# EAGLE design ESR_NM8032 (EAGLE 6.4)
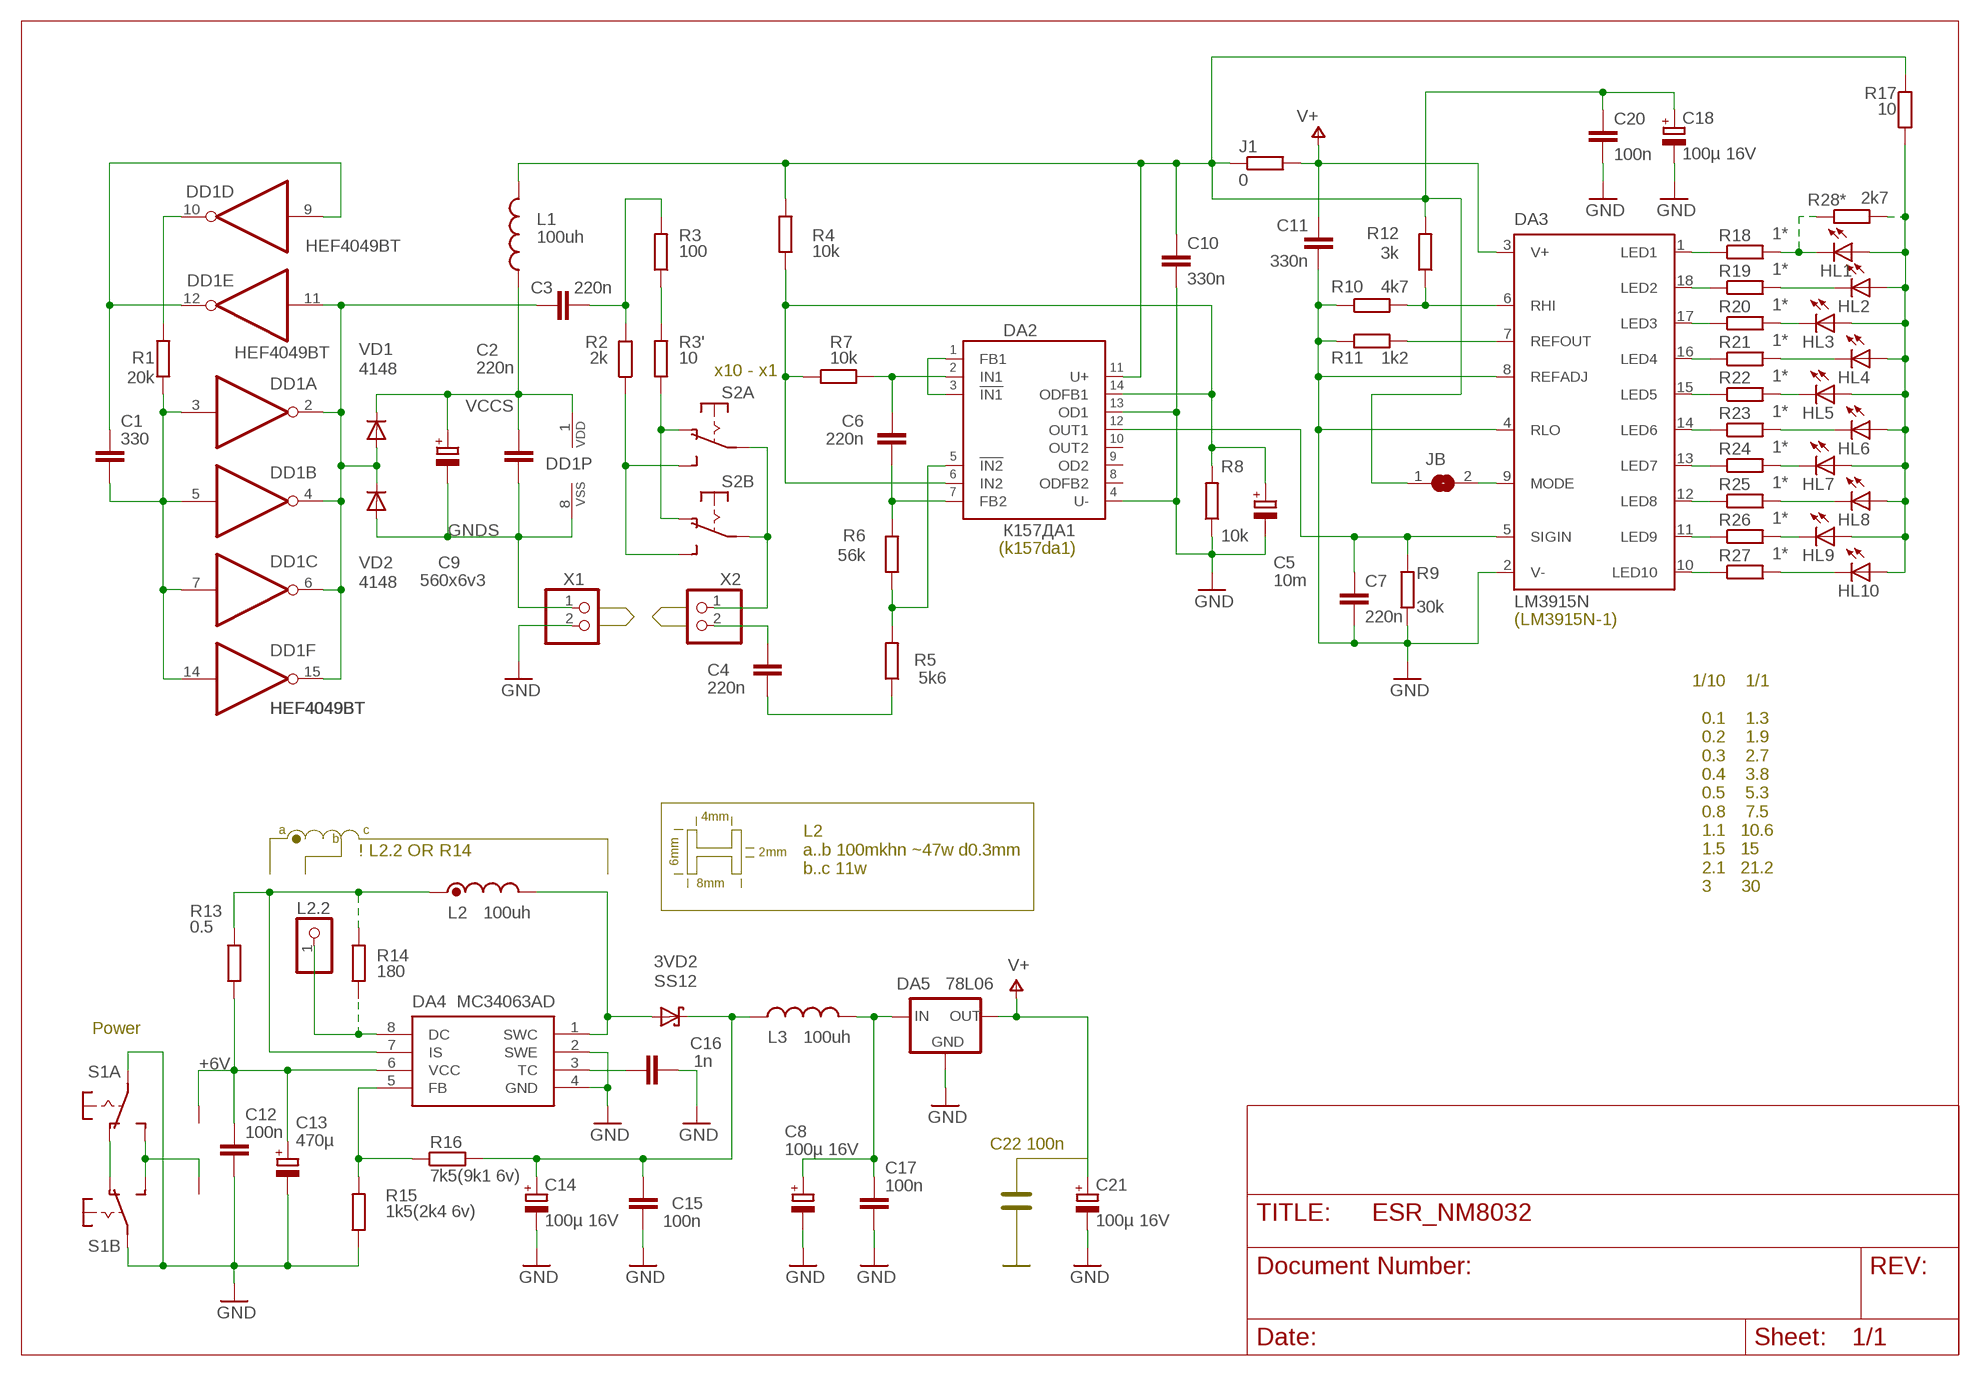
[diagram p0: schematic, sheet 1]

## Parts
3VD2  SS12  SCHOTTKY-DIODESMD  [SMB]
C1  330  C-EUC0805  [C0805]
C2  220n  C-EU075-032X103  [C075-032X103]
C3  220n  C-EUC0805  [C0805]
C4  220n  C-EUC0805  [C0805]
C5  10m  CPOL-EUE2-5  [E2-5]
C6  220n  C-EU075-032X103  [C075-032X103]
C7  220n  C-EUC0805  [C0805]
C8  100µ 16V  RCL_CPOL-EUE2.5-5  [RCL_E2,5-5]
C9  560x6v3  HWPROGUSB_RCL_CPOL-EUE3.5-8  [HWPROGUSB_RCL_E3,5-8]
C10  330n  C-EUC0805  [C0805]
C11  330n  C-EUC0805  [C0805]
C12  100n  C-EUC0805  [C0805]
C13  470µ  RCL_CPOL-EUE2.5-7  [RCL_E2,5-7]
C14  100µ 16V  RCL_CPOL-EUE2.5-5  [RCL_E2,5-5]
C15  100n  C-EUC0805  [C0805]
C16  1n  C-EUC0805  [C0805]
C17  100n  C-EUC0805  [C0805]
C18  100µ 16V  RCL_CPOL-EUE2.5-5  [RCL_E2,5-5]
C20  100n  C-EUC0805  [C0805]
C21  100µ 16V  RCL_CPOL-EUE2.5-5  [RCL_E2,5-5]
DA2  К157ДА1  K157DA1  [DIL14]
DA3  LM3915N  [DIL18]
DA4  MC34063AD  [SOIC8]
DA5  78L06  78LXX_SOT89  [SOT89R]
DD1  HEF4049BT  4049D  [SO16]
HL1  LED3MM  [LED3MM]
HL2  LED3MM  [LED3MM]
HL3  LED3MM  [LED3MM]
HL4  LED3MM  [LED3MM]
HL5  LED3MM  [LED3MM]
HL6  LED3MM  [LED3MM]
HL7  LED3MM  [LED3MM]
HL8  LED3MM  [LED3MM]
HL9  LED3MM  [LED3MM]
HL10  LED3MM  [LED3MM]
J1  0  R-EU_R1206W  [R1206W]
JB  SJ  [SJ]
L1  100uh  L-US0207/10  [0207/10]
L2  100uh  L-US0204/7  [0204/7]
L2.2  PINHD-1X1  [1X01]
L3  100uh  L-US0207/10  [0207/10]
R1  20k  R-EU_M0805  [M0805]
R2  2k  R-EU_M0805  [M0805]
R3  100  R-EU_M0805  [M0805]
R3'  10  R-EU_M0805  [M0805]
R4  10k  R-EU_R0805  [R0805]
R5  5k6  R-EU_M0805  [M0805]
R6  56k  R-EU_R0805  [R0805]
R7  10k  R-EU_R0805  [R0805]
R8  10k  R-EU_R0805  [R0805]
R9  30k  R-EU_R0805  [R0805]
R10  4k7  R-EU_R0805  [R0805]
R11  1k2  R-EU_R0805  [R0805]
R12  3k  R-EU_R0805  [R0805]
R13  0.5  R-EU_M1206  [M1206]
R14  180  R-EU_M0805  [M0805]
R15  1k5(2k4 6v)  R-EU_M0805  [M0805]
R16  7k5(9k1 6v)  R-EU_M0805  [M0805]
R17  10  R-EU_R0805  [R0805]
R18  1*  R-EU_R0805  [R0805]
R19  1*  R-EU_R0805  [R0805]
R20  1*  R-EU_R0805  [R0805]
R21  1*  R-EU_R0805  [R0805]
R22  1*  R-EU_R0805  [R0805]
R23  1*  R-EU_R0805  [R0805]
R24  1*  R-EU_R0805  [R0805]
R25  1*  R-EU_R0805  [R0805]
R26  1*  R-EU_R0805  [R0805]
R27  1*  R-EU_R0805  [R0805]
R28*  2k7  R-EU_R0805  [R0805]
S1  SWITCH9X4  [SWITCH9X4]
S2  SWITCH9X4  [SWITCH9X4]
U$2  B-  [B-]
U$4  B+  [B+]
VD1  4148  DIODE-SOD80C  [SOD80C]
VD2  4148  DIODE-SOD80C  [SOD80C]
X1  PINHD-1X2/2  [1X02]
X2  PINHD-1X2/2  [1X02]

## Nets
+6V: C12.1 C13.+ DA4.6(VCC) R13.1 U$4.P$1
GND: C5.- C7.2 C8.- C10.2 C11.2 C12.2 C13.- C14.- C15.1 C16.2 C17.2 C18.- C20.2 C21.- DA2.4(U-) DA2.13(OD1) DA3.2(V-) DA3.4(RLO) DA3.8(REFADJ) DA4.2(SWE) DA4.4(GND) DA5.3(GND) DA5.4(GND) R8.1 R9.1 R10.1 R11.1 R15.1 S1.10(A:P) S1.20(B:P) X1.2
GNDS: C2.2 C9.- DD1.8(P:VSS) VD2.A X1.1
N$1: C1.2 DD1.3(A:I) DD1.5(B:I) DD1.7(C:I) DD1.14(F:I) R1.1
N$2: C3.1 DD1.2(A:O) DD1.4(B:O) DD1.6(C:O) DD1.11(E:I) DD1.15(F:O) VD1.A VD2.C
N$3: HL1.K(C) R18.2 R28*.1
N$4: C1.1 DD1.9(D:I) DD1.12(E:O)
N$5: HL2.K(C) R19.2
N$6: DD1.10(D:O) R1.2
N$7: HL3.K(C) R20.2
N$8: HL4.K(C) R21.2
N$9: HL5.K(C) R22.2
N$10: HL6.K(C) R23.2
N$11: HL7.K(C) R24.2
N$12: HL8.K(C) R25.2
N$13: HL9.K(C) R26.2
N$14: HL10.K(C) R27.2
N$16: S2.10(A:P) S2.20(B:P) X2.1
N$17: R3'.2 R3.1
N$18: DA2.1(FB1) DA2.3(!IN1)
N$19: C4.1 X2.2
N$20: DA3.7(REFOUT) R11.2
N$21: DA3.6(RHI) R10.2 R12.1
N$22: C4.2 R5.1
N$23: S1.12(A:S) S1.22(B:S) U$2.P$1
N$24: C7.1 DA2.12(OUT1) DA3.5(SIGIN) R9.2
N$25: S1.11(A:O) S1.21(B:O)
N$26: C3.2 R2.2 R3.2
N$27: DA3.1(LED1) R18.1
N$28: HL1.A HL2.A HL3.A HL4.A HL5.A HL6.A HL7.A HL8.A HL9.A HL10.A R17.2 R28*.2
N$29: DA2.5(!IN2) R5.2 R6.1
N$30: DA4.8(DC) L2.2.1 R14.1
N$31: DA4.7(IS) L2.1 R13.2 R14.2
N$32: DA4.5(FB) R15.2 R16.1
N$33: 3VD2.A DA4.1(SWC) L2.2
N$34: C16.1 DA4.3(TC)
N$35: C6.1 DA2.2(IN1) R7.2
N$36: C6.2 DA2.7(FB2) R6.2
N$37: C5.+ DA2.6(IN2) DA2.14(ODFB1) R4.1 R7.1 R8.2
N$38: 3VD2.C C14.+ C15.2 L3.1 R16.2
N$39: DA3.18(LED2) R19.1
N$40: R3'.1 S2.11(A:O) S2.21(B:O)
N$41: C10.1 C18.+ C20.1 DA2.11(U+) J1.1 JB.1 L1.2 R4.2 R12.2 R17.1
N$42: R2.1 S2.12(A:S) S2.22(B:S)
N$43: DA3.17(LED3) R20.1
N$44: DA3.16(LED4) R21.1
N$45: DA3.15(LED5) R22.1
N$46: DA3.14(LED6) R23.1
N$47: DA3.13(LED7) R24.1
N$48: DA3.12(LED8) R25.1
N$49: DA3.11(LED9) R26.1
N$50: DA3.10(LED10) R27.1
N$54: DA3.9(MODE) JB.2
N$55: C8.+ C17.1 DA5.1(IN) L3.2
V+: C11.1 C21.+ DA3.3(V+) DA5.2(OUT) J1.2
VCCS: C2.1 C9.+ DD1.1(P:VDD) L1.1 VD1.C
Unconnected: DA2.8(ODFB2) DA2.9(OD2) DA2.10(OUT2)

## Notes on the sheet
- x10 - x1
- (k157da1)
- (LM3915N-1)
- 4mm
- a | c
- b
- ! L2.2 OR R14 | 2mm
- 6mm
- L2 
  a..b 100mkhn ~47w d0.3mm
  b..c 11w
- 8mm
- 1/10    1/1
  
    0.1    1.3
    0.2    1.9
    0.3    2.7
    0.4    3.8
    0.5    5.3
    0.8    7.5
    1.1   10.6
    1.5   15
    2.1   21.2
    3      30
- Power
- C22 100n

## Library data of the parts
3VD2 = diode:SCHOTTKY-DIODE: Schottky Diode
C1-C4 C6 C7 C10 C11 C15-C17 C20 = rcl:C-EU: CAPACITOR, European symbol
C5 = rcl:CPOL-EU: POLARIZED CAPACITOR, European symbol
C8 C13 C14 C18 C21 = HWProgUSB:RCL_CPOL-EU: POLARIZED CAPACITOR, European symbol
C9 = HWProgUSB:HWPROGUSB_RCL_CPOL-EU: POLARIZED CAPACITOR, European symbol
C12 = rc-elektronik:C-EU: CAPACITOR, European symbol
DA2 = ESR_NM8032:K157DA1
DA3 = national-semiconductor:LM391: Dot/Bar Display Driver Source: Data sheet LM3915 <http://www.national.com/ds/LM/LM3915.pdf> Data sheet LM3914 <http://www.national.com/ds/LM/LM3914.pdf>
DA4 = mc34063:MC34063
DA5 = ct-pack:78LXX: VOLTAGE REGULATOR
DD1 = 40xx:4049: Hex inverting BUFFER
HL1-HL10 = led:LED: LED OSRAM: - CHIPLED LG R971, LG N971, LY N971, LG Q971, LY Q971, LO R971, LY R971 LH N974, LH R974 LS Q976, LO Q976, LY Q976 LO Q996 - Hyper CHIPLED LW Q18S LB Q993, LB Q99A, LB R99A - SideLED LS A670, LO A670, LY A670, LG A670, LP A670 LB A673, LV A673, LT A673, LW A673 LH A674 LY A675 LS A676, LA A676, LO A676, LY A676, LW A676 LS A679, LY A679, LG A679 - Hyper Micro SIDELED® LS Y876, LA Y876, LO Y876, LY Y876 LT Y87S - SmartLED LW L88C, LW L88S LB L89C, LB L89S, LG L890 LS L89K, LO L89K, LY L89K LS L896, LA L896, LO L896, LY L896 - TOPLED LS T670, LO T670, LY T670, LG T670, LP T670 LSG T670, LSP T670, LSY T670, LOP T670, LYG T670 LG T671, LOG T671, LSG T671 LB T673, LV T673, LT T673, LW T673 LH T674 LS T676, LA T676, LO T676, LY T676, LB T676, LH T676, LSB T676, LW T676 LB T67C, LV T67C, LT T67C, LS T67K, LO T67K, LY T67K, LW E67C LS E67B, LA E67B, LO E67B, LY E67B, LB E67C, LV E67C, LT E67C LW T67C LS T679, LY T679, LG T679 LS T770, LO T770, LY T770, LG T770, LP T770 LB T773, LV T773, LT T773, LW T773 LH T774 LS E675, LA E675, LY E675, LS T675 LS T776, LA T776, LO T776, LY T776, LB T776 LHGB T686 LT T68C, LB T68C - Hyper Mini TOPLED® LB M676 - Mini TOPLED Santana® LG M470 LS M47K, LO M47K, LY M47K Source: http://www.osram.convergy.de LUXEON: - LUMILED® LXK2-PW12-R00, LXK2-PW12-S00, LXK2-PW14-U00, LXK2-PW14-V00 LXK2-PM12-R00, LXK2-PM12-S00, LXK2-PM14-U00 LXK2-PE12-Q00, LXK2-PE12-R00, LXK2-PE12-S00, LXK2-PE14-T00, LXK2-PE14-U00 LXK2-PB12-K00, LXK2-PB12-L00, LXK2-PB12-M00, LXK2-PB14-N00, LXK2-PB14-P00, LXK2-PB14-Q00 LXK2-PR12-L00, LXK2-PR12-M00, LXK2-PR14-Q00, LXK2-PR14-R00 LXK2-PD12-Q00, LXK2-PD12-R00, LXK2-PD12-S00 LXK2-PH12-R00, LXK2-PH12-S00 LXK2-PL12-P00, LXK2-PL12-Q00, LXK2-PL12-R00 Source: www.luxeon.com KINGBRIGHT: KA-3528ASYC Source: www.kingbright.com
J1 R1-R3 R3' R4-R27 R28* = rcl:R-EU_: RESISTOR, European symbol
JB = jumper:SJ: SMD solder JUMPER
L1-L3 = rcl:L-US: INDUCTOR, American symbol
L2.2 = pinhead:PINHD-1X1: PIN HEADER
S1 S2 = ESR_NM8032:SWITCH9X4
U$2 = ESR_NM8032:B-
U$4 = ESR_NM8032:B+
VD1 VD2 = diode:DIODE-: DIODE
X1 X2 = Разъёмы штырьковые 2.54мм:PINHD-1X2: PIN HEADER

## Board
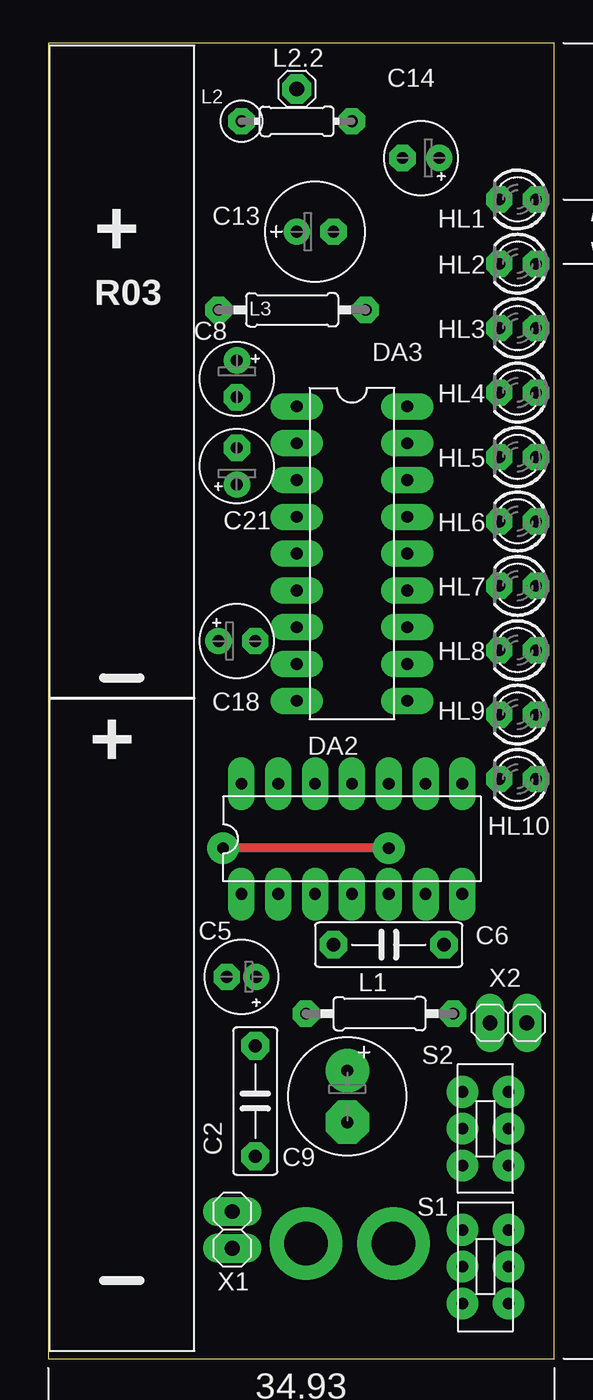
[diagram p1: board, top side]
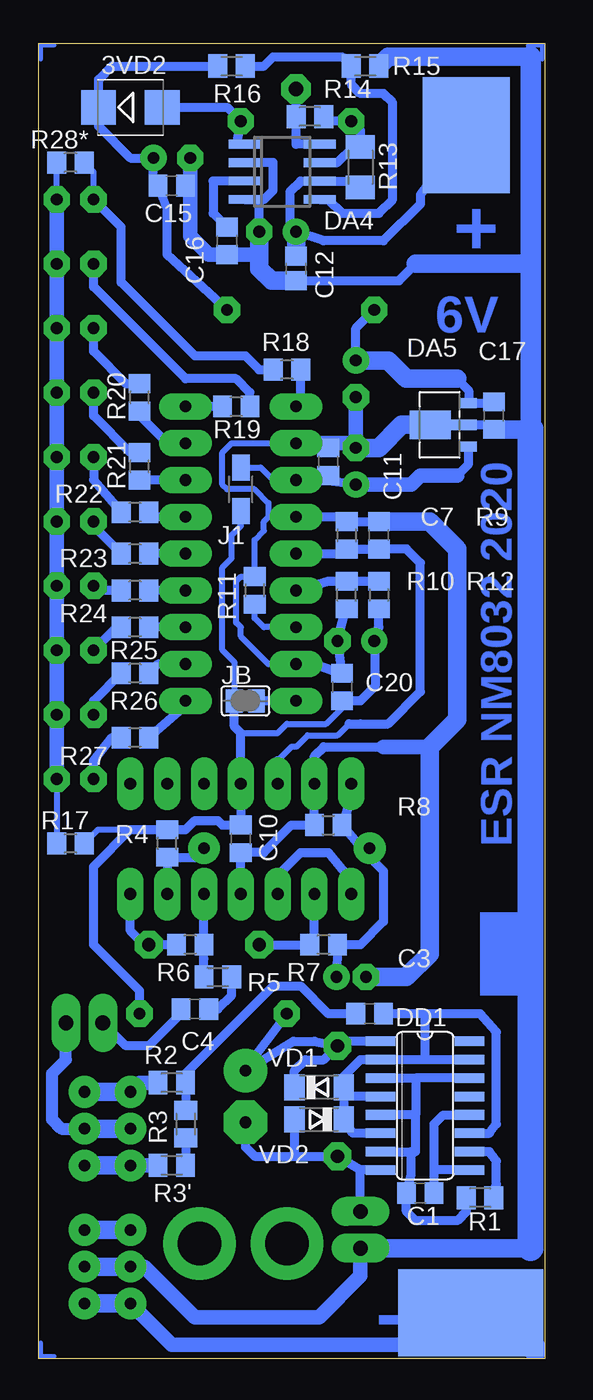
[diagram p2: board, bottom side, seen from below]

Size 34.91 x 90.79 mm. Coordinates in mm from the lower left corner, seen from the top.
Outline: 0,0 34.91,0 34.91,90.79 0,90.79 0,0
Copper layers (1*16): Top 0.035mm / dielectric 1.5mm / Bottom 0.035mm
Design rules "DesignRules": minimum track width 8mil, minimum drill 24mil, track to track 0.2mm, track to pad 0.2mm, pad to pad 8mil, via to via 8mil, smd to smd 8mil, copper to edge 10mil, drill to drill 8mil, minimum pad ring 0.5mm, minimum via ring 8mil, stop-mask expansion 4mil, vias tented up to drill 0mil, thermal gap 10mil

### Footprints (pad centres in the part's own frame; a part is rotated, then mirrored left to right if it is on the bottom)
SMB = smd 2.4 x 2.4: A 2.2,0; C -2.2,0
C0805 = smd 1.3 x 1.5: 1 -0.95,0; 2 0.95,0
C075-032X103 = drill 0.914 octagon: 1 -3.81,0; 2 3.81,0
E2-5 = drill 0.813 pad 1.27: + -1.016,0 | drill 0.813 pad 1.27 octagon: - 1.016,0
RCL_E2,5-5 = drill 0.813 pad 1.6: + -1.27,0 | drill 0.813 pad 1.6 octagon: - 1.27,0
HWPROGUSB_RCL_E3,5-8 = drill 0.813 pad 3: + -1.778,0 | drill 0.813 pad 3 octagon: - 1.778,0
C0805' = smd 1.3 x 1.5: 1 -0.85,0; 2 0.85,0
RCL_E2,5-7 = drill 0.813 pad 1.6: + -1.27,0 | drill 0.813 pad 1.6 octagon: - 1.27,0
DIL14 = drill 0.813 long: 1 -7.62,-3.81; 2 -5.08,-3.81; 3 -2.54,-3.81; 4 0,-3.81; 5 2.54,-3.81; 6 5.08,-3.81; 7 7.62,-3.81; 8 7.62,3.81; 9 5.08,3.81; 10 2.54,3.81; 11 0,3.81; 12 -2.54,3.81; 13 -5.08,3.81; 14 -7.62,3.81
DIL18 = drill 0.813 long: 1 -10.16,-3.81; 2 -7.62,-3.81; 3 -5.08,-3.81; 4 -2.54,-3.81; 5 0,-3.81; 6 2.54,-3.81; 7 5.08,-3.81; 8 7.62,-3.81; 9 10.16,-3.81; 10 10.16,3.81; 11 7.62,3.81; 12 5.08,3.81; 13 2.54,3.81; 14 0,3.81; 15 -2.54,3.81; 16 -5.08,3.81; 17 -7.62,3.81; 18 -10.16,3.81
SOIC8 = smd 0.6 x 2.2: 1 -1.905,-2.6; 2 -0.635,-2.6; 3 0.635,-2.6; 4 1.905,-2.6; 5 1.905,2.6; 6 0.635,2.6; 7 -0.635,2.6; 8 -1.905,2.6
SOT89R = smd 0.7 x 1.1: 1 1.5,-1.75; 2 -1.5,-1.75 | smd 0.7 x 1.8: 3 0,-1.4 | smd 2 x 2.8: 4 0,0.9
SO16 = smd 0.66 x 2.032: 1 -4.445,-3.073; 2 -3.175,-3.073; 3 -1.905,-3.073; 4 -0.635,-3.073; 5 0.635,-3.073; 6 1.905,-3.073; 7 3.175,-3.073; 8 4.445,-3.073; 9 4.445,3.073; 10 3.175,3.073; 11 1.905,3.073; 12 0.635,3.073; 13 -0.635,3.073; 14 -1.905,3.073; 15 -3.175,3.073; 16 -4.445,3.073
LED3MM = drill 0.813 octagon: A -1.27,0; K 1.27,0
R1206W = smd 1.8 x 1.2: 1 -1.499,0; 2 1.499,0
SJ = smd 1.168 x 1.6: 1 -0.762,0; 2 0.762,0
0207/10 = drill 0.813 octagon: 1 -5.08,0; 2 5.08,0
0204/7 = drill 0.813 octagon: 1 -3.81,0; 2 3.81,0
1X01 = drill 1.016 octagon: 1 0,0
M0805 = smd 1.3 x 1.6: 1 -0.95,0; 2 0.95,0
R0805 = smd 1.3 x 1.5: 1 -0.95,0; 2 0.95,0
M1206 = smd 1.6 x 2: 1 -1.4,0; 2 1.4,0
SWITCH9X4 = drill 0.8 pad 2.184: 10 -1.587,0; 11 -1.587,2.54; 12 -1.587,-2.54; 20 1.587,0; 21 1.587,2.54; 22 1.587,-2.54
B- = smd 10 x 6: P$1 0,0
B+ = smd 6 x 8: P$1 0,0
SOD80C = smd 1.4 x 1.8: A 1.7,0; C -1.7,0
1X02 = drill 1.016 long: 1 -1.27,0; 2 1.27,0

### Placement (x,y rotation side)
3VD2  28.57,86.36 0 bottom
C1  8.57,11.43 180 bottom
C2  14.29,17.78 270 top
C3  12.06,23.81 180 bottom
C4  24.13,24.13 0 bottom
C5  13.34,26.35 180 top
C6  23.49,28.57 0 top
C7  11.43,56.83 90 bottom
C8  13.02,67.63 270 top
C9  20.64,18.1 270 top
C10  20.95,35.88 270 bottom
C11  14.92,61.91 90 bottom
C12  100n  [C0805']  17.14,75.25 270 bottom
C13  18.41,77.79 0 top
C14  25.72,82.87 180 top
C15  25.72,80.96 180 bottom
C16  21.91,77.15 270 bottom
C17  3.49,65.09 270 bottom
C18  13.02,49.53 0 top
C20  13.97,46.36 90 bottom
C21  13.02,61.6 90 top
DA2  20.95,35.88 0 top
DA3  20.95,55.56 270 top
DA4  18.1,81.91 270 bottom
DA5  6.99,64.45 90 bottom
DD1  8.26,17.46 270 bottom
HL1  32.39,80.01 180 top
HL2  32.39,75.56 180 top
HL3  32.39,71.12 180 top
HL4  32.39,66.67 180 top
HL5  32.39,62.23 180 top
HL6  32.39,57.79 180 top
HL7  32.39,53.34 180 top
HL8  32.39,48.9 180 top
HL9  32.39,44.45 180 top
HL10  32.39,40.01 180 top
J1  20.95,60.01 90 bottom
JB  20.64,45.4 0 bottom
L1  22.86,23.81 0 top
L2  17.14,85.41 0 top
L2.2  17.14,87.63 0 top
L3  16.83,72.39 180 top
R1  4.45,11.11 0 bottom
R2  25.72,19.05 0 bottom
R3  24.76,16.19 90 bottom
R3'  25.72,13.33 0 bottom
R4  26.04,35.56 90 bottom
R5  22.54,26.35 180 bottom
R6  24.45,28.57 180 bottom
R7  15.24,28.57 180 bottom
R8  14.92,36.83 0 bottom
R9  13.65,56.83 270 bottom
R10  13.65,52.71 90 bottom
R11  20,53.02 270 bottom
R12  11.43,52.71 270 bottom
R13  12.7,82.23 90 bottom
R14  16.19,85.72 0 bottom
R15  12.38,89.22 180 bottom
R16  21.59,89.22 180 bottom
R17  32.7,35.56 180 bottom
R18  17.78,68.26 180 bottom
R19  21.27,65.72 0 bottom
R20  27.94,66.36 90 bottom
R21  27.94,61.6 90 bottom
R22  28.26,58.42 180 bottom
R23  28.26,55.56 180 bottom
R24  28.26,53.02 180 bottom
R25  28.26,50.48 180 bottom
R26  28.26,47.31 180 bottom
R27  28.26,42.86 180 bottom
R28*  32.7,82.55 180 bottom
S1  30.16,6.35 0 top
S2  30.16,15.88 180 top
U$1  [LR03]  5.08,22.54 90 top
U$2  5.08,3.17 0 bottom
U$3  [LR03]  5.08,67.63 90 top
U$4  5.4,84.45 0 bottom
VD1  15.56,18.73 0 bottom
VD2  15.56,16.51 180 bottom
X1  12.7,8.89 270 top
X2  31.75,23.18 180 top

### Tracks (layer width: path | path; a pad name or v marks a point on that pad's centre or on a via)
+6V
  Bottom 0.61: U$4.P$1 8.57,80.33 8.57,79.69 11.11,77.15 15.24,77.15 C13.+ 17.56,78.21 17.56,80.54 16.83,81.28 DA4.6 13.15,81.28 R13.1
  Bottom 1.27: C13.+ C12.1
GND
  Bottom 0.305: 0.16,89.69 0.16,90.65 1.11,90.65 1.11,89.85
  Bottom 0.406: DA3.8 19.05,47.94 20.95,49.85 20.95,50.48 21.27,50.8 21.27,53.66 20.95,53.98 R11.1 20,56.52 19.37,57.15 19.37,57.79 19.05,58.1 | DA3.2 21.59,63.18 22.22,62.55 22.22,60.32 21.91,60.01 20,60.01 19.05,59.05 19.05,58.1 | DA3.4 19.05,58.1
  Bottom 0.61: DA2.4 C10.2 19.36,34.93 17.46,36.83 R8.1 15.88,38.1 DA2.13 15.88,41.59 15.24,42.23 11.11,42.23 | DA4.4 19.68,80.01 | 19.68,80.01 19.37,80.01 18.73,80.64 18.73,82.55 DA4.2 | R10.1 13.72,51.69 C18.- 14.03,47.56 C20.2 15.88,47.94 DA3.8 | C7.2 R9.1 14.29,58.1 DA3.4 | DA5.4 DA5.3 3.81,64.45 C17.2 | C13.- 19.68,80.01 | C11.2 14.92,63.18 | C12.2 10.06,74.4 8.89,75.56
  Bottom 1.016: 19.68,76.2 C16.2 23.18,76.2 24.45,77.47 24.45,80.96 | X1.2 12.7,5.72 15.56,2.86 24.13,2.86 27.62,6.35 S1.10 | 12.77,62.86 C21.- | C21.- C8.- | DA3.2 14.92,63.18 13.59,63.18 C21.- | 11.11,42.23 7.94,42.23 | C14.- 24.45,80.96 | C15.1 24.45,80.96
  Bottom 1.27: 0.95,89.85 1.11,89.85 10.8,89.85 R15.1 | 0.95,7.62 X1.2 | C17.2 1.59,64.14 0.95,64.13 | C13.- 19.68,76.2 19.68,75.25 18.83,74.4 C12.2 | C5.- 9.53,26.35 7.94,27.94 7.94,42.23 6.03,44.13 6.03,55.88 7.94,57.78 C7.2 | S1.10 S1.20 | DA5.4 9.84,64.45 11.43,62.87 C21.- | 8.89,75.56 0.95,75.56
  Bottom 1.422: 0.95,64.13 0.95,75.56 0.95,89.85
  Bottom 1.778: 0.95,7.62 0.95,64.13
GNDS
  Bottom 0.61: DD1.8 12.7,13.02 | 12.7,13.02 C2.2 17.26,13.97 | VD2.A 17.26,13.97 | X1.1 12.7,13.02 | C9.- 20.64,14.61 20,13.97 17.26,13.97
N$1
  Bottom 0.61: DD1.14 8.89,19.37 | DD1.3 8.89,19.37 | 8.89,19.37 8.89,16.83 | 8.89,16.83 DD1.5 | DD1.7 9.21,14.29 | 9.21,14.29 8.89,14.29 8.89,16.83 | R1.1 5.4,10.16 6.03,9.52 8.89,9.52 9.53,10.16 C1.2 9.21,12.7 9.21,14.29
N$2
  Bottom 0.61: DD1.11 3.81,15.56 3.33,16.19 3.33,22.54 4.45,23.81 8.26,23.81 | 8.26,23.81 8.26,20.64 | DD1.15 8.26,20.64 | 8.26,20.64 DD1.2 12.7,20.64 13.86,19.48 VD1.A 13.86,18.1 | 13.86,18.1 VD2.C 13.22,15.56 DD1.6 | DD1.4 13.86,18.1 | 8.26,23.81 C3.1
N$3
  Bottom 0.406: HL1.K 31.11,81.91 R28*.1
  Bottom 0.61: HL1.K 29.21,78.1 29.21,74.3 24.13,69.21 20.64,69.21 19.68,68.26 R18.2
N$4
  Bottom 0.61: 7.62,13.02 7.62,16.19 6.99,16.83 DD1.12 | DD1.9 7.62,13.02 | C1.1 7.62,13.02
N$5
  Bottom 0.61: R19.2 20.32,66.68 21.27,67.63 24.76,67.63 31.11,73.98 HL2.K
N$6
  Bottom 0.61: R1.2 3.33,12.07 3.33,13.65 3.81,14.29 DD1.10
N$7
  Bottom 0.61: HL3.K 31.11,69.53 28.89,67.31 R20.2
N$8
  Bottom 0.61: HL4.K 31.11,65.09 28.57,62.55 R21.2
N$9
  Bottom 0.61: HL5.K 31.11,60.65 R22.2
N$10
  Bottom 0.61: HL6.K 31.11,57.47 R23.2
N$11
  Bottom 0.61: R24.2 30.8,53.02 HL7.K
N$12
  Bottom 0.61: HL8.K 29.53,50.48 R25.2
N$13
  Bottom 0.61: HL9.K 31.11,45.4 R26.2
N$14
  Bottom 0.61: HL10.K 31.11,41.28 29.84,42.86 R27.2
N$15  (via drill 3 pad 5)
  other vias: 23.81,7.94
N$16
  Bottom 0.813: X2.1 33.02,20.64 33.97,19.68 33.97,16.51 33.34,15.88 S2.10
  Bottom 1.27: S2.10 S2.20
N$17
  Bottom 0.61: R3.1 R3'.2
N$18
  Bottom 0.61: DA2.3 18.41,33.34 16.83,34.93 14.92,34.93 13.34,33.02 DA2.1
N$19
  Bottom 0.61: C4.1 25.08,23.81 27.3,21.59 28.89,21.59 X2.2
N$20
  Bottom 0.406: DA3.7 19.37,50.48 20,51.12 R11.2
N$21
  Bottom 0.61: DA3.6 14.92,53.66 R10.2 R12.1
N$22
  Bottom 0.61: C4.2 22.54,24.13 21.59,25.08 R5.1
N$23
  Bottom 0.305: 0.16,1.11 0.16,0.16 1.11,0.16 U$2.P$1
  Bottom 1.016: 7.3,0.95 25.72,0.95 S1.12
  Bottom 1.27: U$2.P$1 7.3,0.95 | S1.12 S1.22
N$24
  Bottom 0.406: 13.48,43.81 14.27,43.02 16.35,43.02 17.14,42.23 17.46,42.23 18.41,41.28
  Bottom 0.61: DA3.5 14.29,55.56 R9.2 C7.1 9.53,55.88 8.57,54.93 8.57,46.04 10.79,43.82 12.7,43.82 13.48,43.81 | DA2.12 18.41,41.28
N$25
  Bottom 1.27: S1.11 S1.21
N$26
  Bottom 0.61: C3.2 14.92,23.81 16.83,25.72 18.73,25.72 24.77,19.68 R2.2 R3.2
N$27
  Bottom 0.61: DA3.1 16.83,66.04 R18.1
N$28
  Bottom 0.406: HL10.A R17.2 | HL1.A R28*.2
  Bottom 1.016: HL1.A HL2.A HL3.A HL4.A HL5.A HL6.A HL7.A HL8.A HL9.A HL10.A
N$29
  Bottom 0.61: DA2.5 23.5,31.75 R6.1 23.5,27.62 R5.2
N$30
  Bottom 0.61: L2.2.1 R14.1 17.14,83.82 DA4.8
N$31
  Bottom 0.61: R14.2 15.24,85.41 L2.1 12.7,84.77 R13.2 13.21,83.63 14.29,82.55 DA4.7
N$32
  Bottom 0.61: DA4.5 14.92,80.01 13.97,79.06 11.43,79.06 10.48,80.01 10.48,86.68 11.11,87.31 12.7,87.31 13.34,87.95 R15.2 13.97,89.85 18.73,89.85 19.37,89.22 R16.1
N$33
  Bottom 0.61: DA4.1 21.27,83.82 L2.2 21.91,86.36 3VD2.A
N$34
  Bottom 0.61: DA4.3 22.86,81.28 22.86,79.06 C16.1
N$35
  Bottom 0.61: C6.1 R7.2 15.88,28.57 DA2.2
N$36
  Bottom 0.61: DA2.7 28.57,29.53 27.62,28.57 C6.2 R6.2
N$37  (via drill 0.8 pad 2.18)
  Top 0.61: v23.49,35.24 v12.06,35.24
  Bottom 0.61: DA2.6 R4.1 23.81,34.61 v23.49,35.24 | DA2.14 13.34,38.74 R8.2 12.38,34.93 | v12.06,35.24 12.38,34.93 | C5.+ R7.1 12.7,28.57 11.11,30.16 11.11,33.65 12.38,34.93
N$38
  Bottom 0.61: R16.2 29.84,89.22 30.77,88.29 3VD2.C 30.77,85.07 28.57,82.87 C14.+ 26.99,81.28 C15.2 26.04,79.38 26.04,76.2 L3.1
N$39
  Bottom 0.61: R19.1 DA3.18
N$40
  Bottom 1.016: R3'.1 S2.21
  Bottom 1.27: S2.11 S2.21
N$41
  Bottom 0.406: J1.1 20.95,57.47 21.59,56.83 21.59,55.25 22.22,54.61 22.22,48.9 21.4,48.07 JB.1 | 20.95,43.18 18.41,43.18 17.78,43.82 15.08,43.82 13.97,44.92 C20.1 | R17.1 30.8,36.51 28.26,36.51
  Bottom 0.61: C20.1 12.7,45.4 11.68,46.42 C18.+ 11.43,50.48 R12.2 | L1.2 27.94,25.4 31.11,28.57 31.11,33.97 28.57,36.51 28.26,36.51 R4.2 24.77,36.51 24.13,37.15 22.54,37.15 22.22,36.83 C10.1 DA2.11 20.95,43.18 21.4,43.62 JB.1
N$42
  Bottom 1.016: R2.1 27.94,19.05 S2.22
  Bottom 1.27: S2.12 S2.22
N$43
  Bottom 0.61: R20.1 27.94,65.09 26.04,63.18 DA3.17
N$44
  Bottom 0.61: DA3.16 R21.1
N$45
  Bottom 0.61: DA3.15 26.67,58.1 R22.1
N$46
  Bottom 0.61: DA3.14 R23.1
N$47
  Bottom 0.61: DA3.13 R24.1
N$48
  Bottom 0.61: DA3.12 R25.1
N$49
  Bottom 0.61: DA3.11 26.67,47.94 R26.1
N$50
  Bottom 0.61: DA3.10 24.76,45.09 R27.1
N$51
  Bottom 0.305: 33.81,0.16 34.77,0.16 34.77,1.11
N$52
  Bottom 0.305: 33.81,90.65 34.77,90.65 34.77,89.69
N$53  (via drill 3 pad 5)
  other vias: 17.78,7.94
N$54
  Bottom 0.61: DA3.9 JB.2
N$55
  Bottom 0.61: 6.03,67.63 5.24,66.83 DA5.1 3.58,65.95 C17.1 | C8.+ 13.02,71.12 L3.2
  Bottom 1.27: C8.+ 10.79,68.9 9.53,67.63 6.03,67.63
V+
  Bottom 0.406: J1.2 19.6,61.51 18.73,60.64 DA3.3
  Bottom 0.61: 6.03,60.96 5.24,61.76 DA5.2 | C21.+ 14.92,60.58 | 14.92,60.58 17.08,60.58 DA3.3 | C11.1 14.92,60.58
  Bottom 1.016: 6.03,60.96 8.57,60.96 9.21,60.32 C21.+
VCCS
  Bottom 0.61: DD1.1 13.65,21.91 C2.1 | L1.1 20.64,20 C9.+ 17.34,21.91 15.88,21.91 C2.1 | VD1.C 17.26,19.89 16.51,20.64 15.24,20.64 C2.1
(copper drawn outside any net)
  shapes: Bottom area x1

### Text on the board
Bottom: + | 6V | ESR NM8032 2020 | -
tPlace: + | R03 | +
tDocu: 1/1 / / 1.3 / 1.9 / 2.7 / 3.8 / 5.3 / 7.5 / 10.6 / 15 / 21.2 / 30 | 1/10 / / 0.1 / 0.2 / 0.3 / 0.4 / 0.5 / 0.8 / 1.1 / 1.5 / 2.1 / 3
Modules: X1 / X10